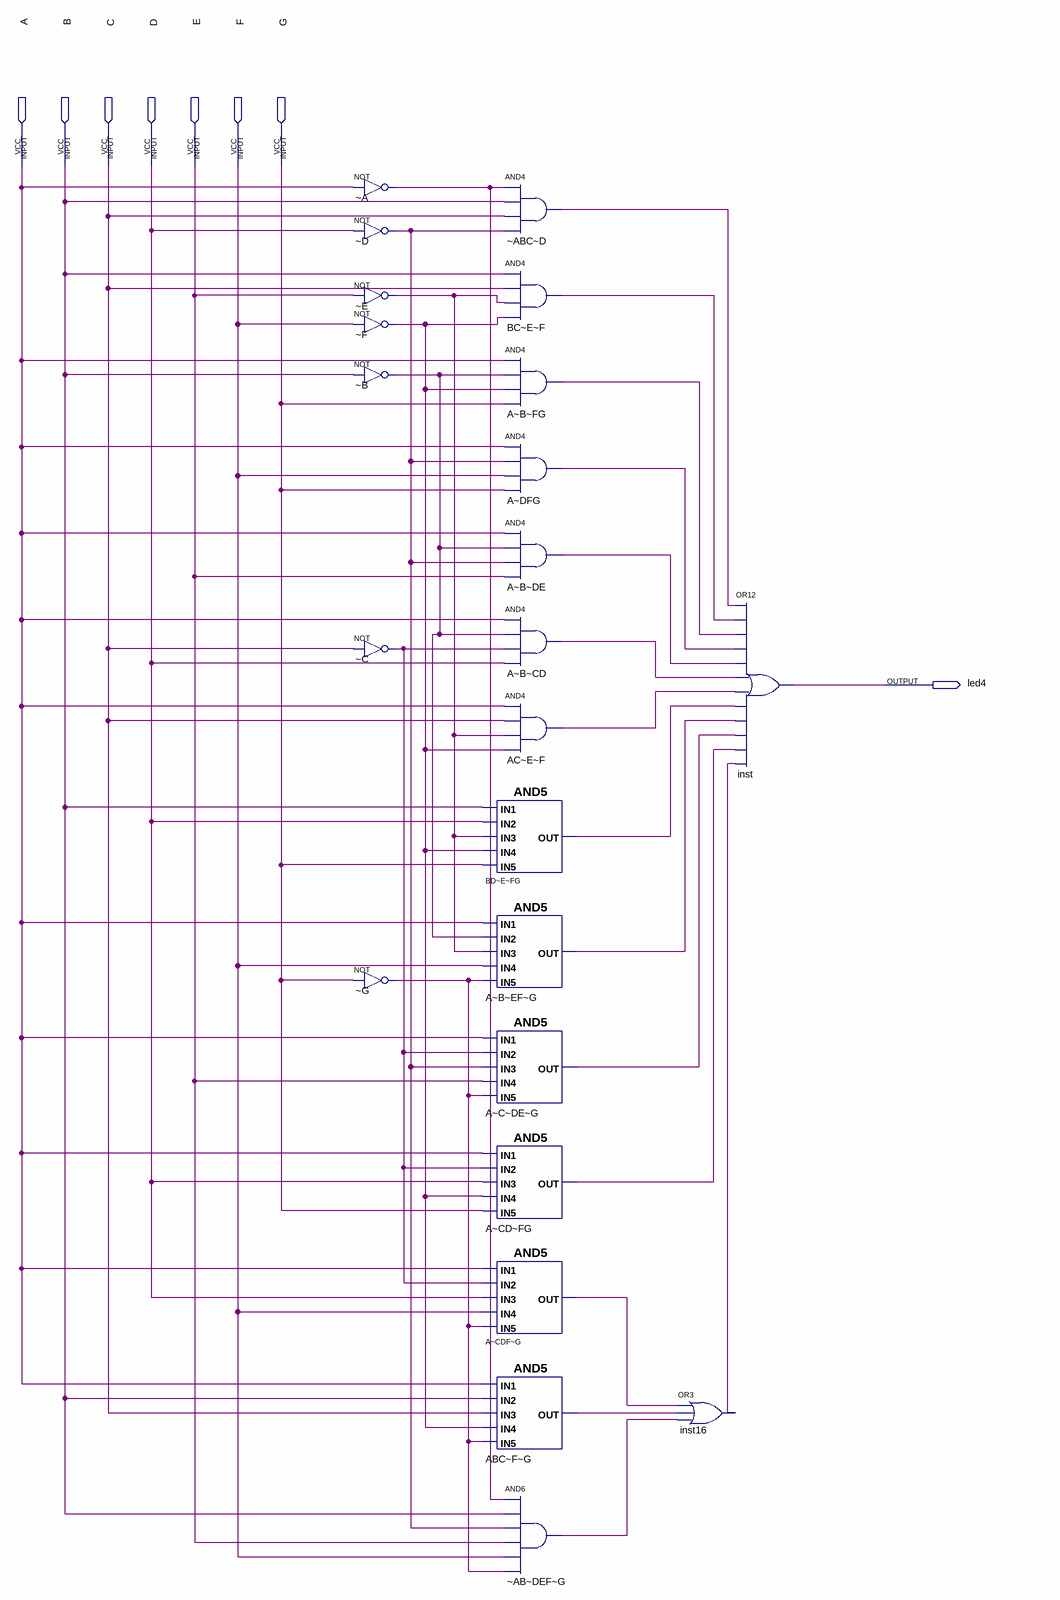
[diagram p0: schematic sheet]
// Quartus schematic LED4.bdf as structural Verilog: 23 symbols, 8 pins
module LED4 (
  input  A,
  input  B,
  input  C,
  input  D,
  input  E,
  input  F,
  input  G,
  output led4
);

  wire _A_out, _AB_DEF_G_out, _ABC_D_out, _B_out, _C_out, _D_out, _E_out, _F_out, _G_out, A_B_CD_out,
       A_B_DE_out, A_B_EF_G_out, A_B_FG_out, A_C_DE_G_out, A_CD_FG_out, A_CDF_G_out, A_DFG_out, ABC_F_G_out,
       AC_E_F_out, BC_E_F_out, BD_E_FG_out, inst16_out;

  not \u_~A  (_A_out, A);
  not \u_~D  (_D_out, D);
  not \u_~E  (_E_out, E);
  not \u_~F  (_F_out, F);
  not \u_~B  (_B_out, B);
  not \u_~C  (_C_out, C);
  not \u_~G  (_G_out, G);
  and \u_~ABC~D  (_ABC_D_out, _A_out, B, C, _D_out);
  and \BC~E~F  (BC_E_F_out, B, C, _E_out, _F_out);
  and \A~B~FG  (A_B_FG_out, A, _B_out, _F_out, G);
  and \A~DFG  (A_DFG_out, A, _D_out, F, G);
  and \A~B~DE  (A_B_DE_out, A, _B_out, _D_out, E);
  and \A~B~CD  (A_B_CD_out, A, _B_out, _C_out, D);
  and \AC~E~F  (AC_E_F_out, A, C, _E_out, _F_out);
  and \BD~E~FG  (BD_E_FG_out, B, D, _E_out, _F_out, G);
  and \A~B~EF~G  (A_B_EF_G_out, A, _B_out, _E_out, F, _G_out);
  and \A~C~DE~G  (A_C_DE_G_out, A, _C_out, _D_out, E, _G_out);
  and \A~CD~FG  (A_CD_FG_out, A, _C_out, D, _F_out, G);
  and \A~CDF~G  (A_CDF_G_out, A, _C_out, D, F, _G_out);
  and \ABC~F~G  (ABC_F_G_out, A, B, C, _F_out, _G_out);
  and \u_~AB~DEF~G  (_AB_DEF_G_out, _A_out, B, _D_out, E, F, _G_out);
  or inst16 (inst16_out, A_CDF_G_out, ABC_F_G_out, _AB_DEF_G_out);
  or inst (led4, _ABC_D_out, BC_E_F_out, A_B_FG_out, A_DFG_out, A_B_DE_out, A_B_CD_out, AC_E_F_out, BD_E_FG_out, A_B_EF_G_out, A_C_DE_G_out, A_CD_FG_out, inst16_out);
endmodule
